# EAGLE design ltc3886_breadboardbreakout (EAGLE 9.3.0)
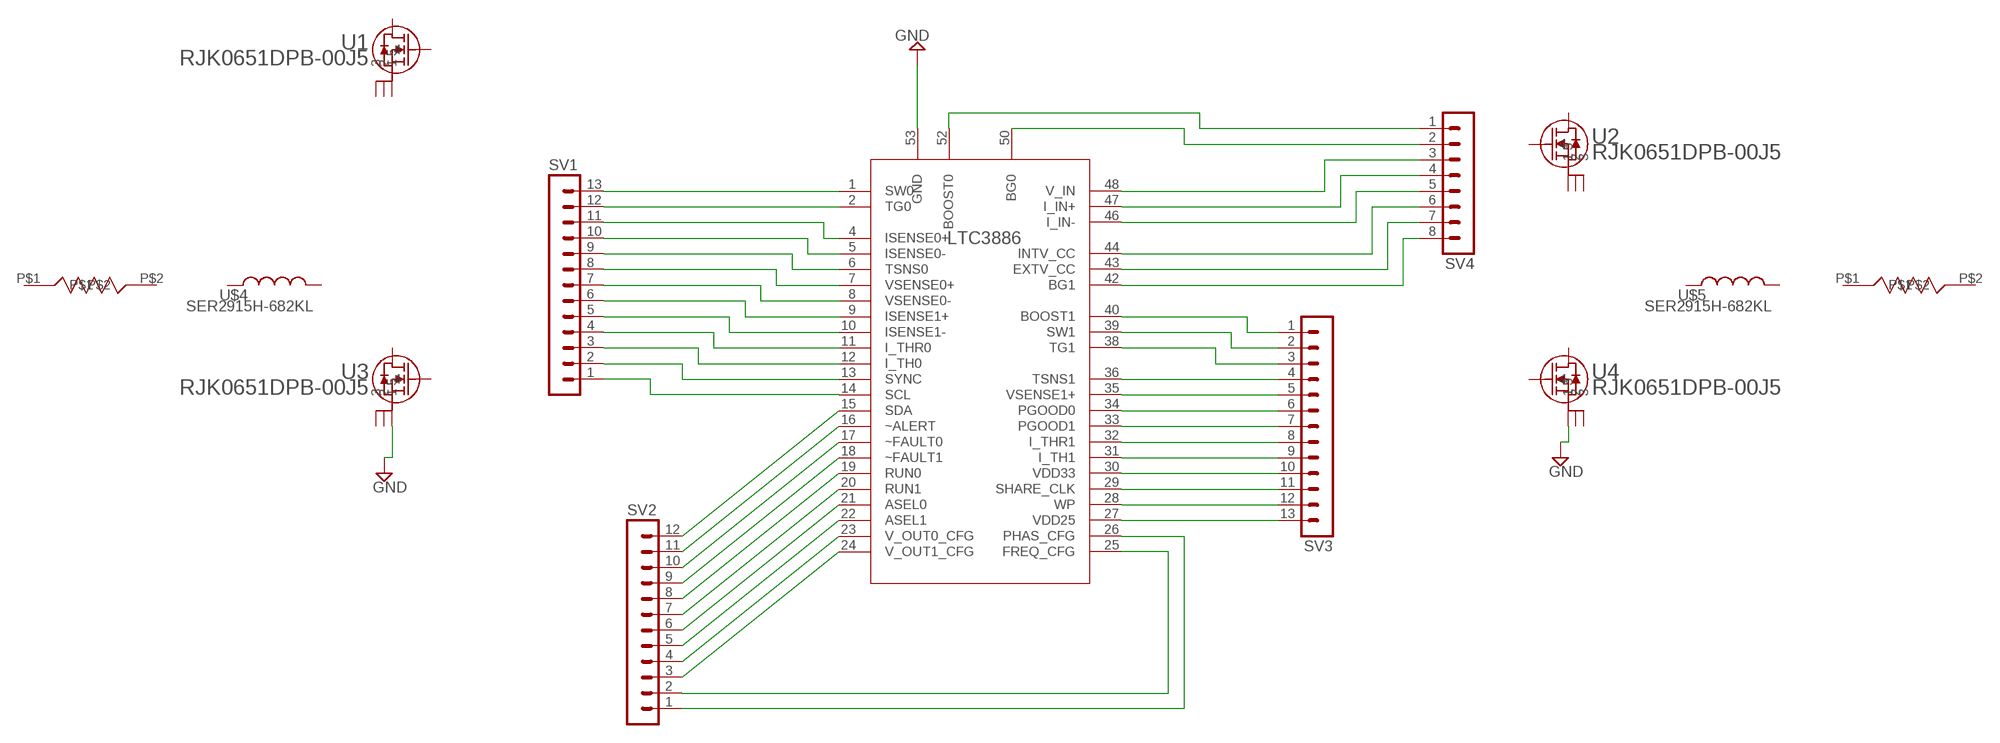
[diagram p0: schematic, sheet 1]

## Parts
GND  LTC3886  [QFN-52_UKG_2]
SV1  MA13-1  [MA13-1]
SV2  MA12-1  [MA12-1]
SV3  MA13-1  [MA13-1]
SV4  MA08-1  [MA08-1]
U1  RJK0651DPB-00J5  [LFPAK]
U2  RJK0651DPB-00J5  [LFPAK]
U3  RJK0651DPB-00J5  [LFPAK]
U4  RJK0651DPB-00J5  [LFPAK]
U$2  CSS2H-2512K-2L00FE  [CSS2H-2512K-2L00FE]
U$3  CSS2H-2512K-2L00FE  [CSS2H-2512K-2L00FE]
U$4  SER2915H-682KL  [SER2915H-682KL]
U$5  SER2915H-682KL  [SER2915H-682KL]

## Nets
GND: GND.53(GND) U3.1 U4.1
N$5: GND.1(SW0) SV1.13
N$6: GND.2(TG0) SV1.12
N$7: GND.4(ISENSE0+) SV1.11
N$8: GND.5(ISENSE0-) SV1.10
N$9: GND.6(TSNS0) SV1.9
N$10: GND.7(VSENSE0+) SV1.8
N$11: GND.8(VSENSE0-) SV1.7
N$12: GND.9(ISENSE1+) SV1.6
N$13: GND.10(ISENSE1-) SV1.5
N$14: GND.11(I_THR0) SV1.4
N$15: GND.12(I_TH0) SV1.3
N$16: GND.13(SYNC) SV1.2
N$17: GND.14(SCL) SV1.1
N$18: GND.24(V_OUT1_CFG) SV2.3
N$19: GND.23(V_OUT0_CFG) SV2.4
N$20: GND.22(ASEL1) SV2.5
N$21: GND.21(ASEL0) SV2.6
N$22: GND.20(RUN1) SV2.7
N$23: GND.19(RUN0) SV2.8
N$24: GND.18(~FAULT1) SV2.9
N$25: GND.17(~FAULT0) SV2.10
N$26: GND.16(~ALERT) SV2.11
N$27: GND.15(SDA) SV2.12
N$28: GND.25(FREQ_CFG) SV2.2
N$29: GND.26(PHAS_CFG) SV2.1
N$30: GND.27(VDD25) SV3.13
N$31: GND.28(WP) SV3.12
N$32: GND.29(SHARE_CLK) SV3.11
N$33: GND.30(VDD33) SV3.10
N$34: GND.31(I_TH1) SV3.9
N$35: GND.32(I_THR1) SV3.8
N$36: GND.33(PGOOD1) SV3.7
N$37: GND.34(PGOOD0) SV3.6
N$38: GND.35(VSENSE1+) SV3.5
N$39: GND.36(TSNS1) SV3.4
N$40: GND.38(TG1) SV3.3
N$41: GND.39(SW1) SV3.2
N$42: GND.40(BOOST1) SV3.1
N$43: GND.42(BG1) SV4.8
N$44: GND.43(EXTV_CC) SV4.7
N$45: GND.44(INTV_CC) SV4.6
N$46: GND.46(I_IN-) SV4.5
N$47: GND.47(I_IN+) SV4.4
N$48: GND.48(V_IN) SV4.3
N$49: GND.50(BG0) SV4.2
N$50: GND.52(BOOST0) SV4.1
Unconnected: U1.1 U1.2 U1.3 U1.4 U1.5 U2.1 U2.2 U2.3 U2.4 U2.5 U3.2 U3.3 U3.4 U3.5 U4.2 U4.3 U4.4 U4.5 U$2.P$1 U$2.P$2 U$3.P$1 U$3.P$2 U$4.P$1 U$4.P$2 U$5.P$1 U$5.P$2

## Library data of the parts
GND = ltc3886:LTC3886
SV1 SV3 = con-lstb:MA13-1: PIN HEADER; OC_FARNELL: unknown; OC_NEWARK: unknown
SV2 = con-lstb:MA12-1: PIN HEADER; OC_FARNELL: unknown; OC_NEWARK: unknown
SV4 = con-lstb:MA08-1: PIN HEADER; OC_FARNELL: unknown; OC_NEWARK: unknown
U1-U4 = SamacSys_Parts:RJK0651DPB-00J5; MANUFACTURER_PART_NUMBER: RJK0651DPB00#J5; VENDOR: Renesas Electronics
U$2 U$3 = power_subsystem_components:CSS2H-2512K-2L00FE
U$4 U$5 = power_subsystem_components:SER2915H-682KL

## Board
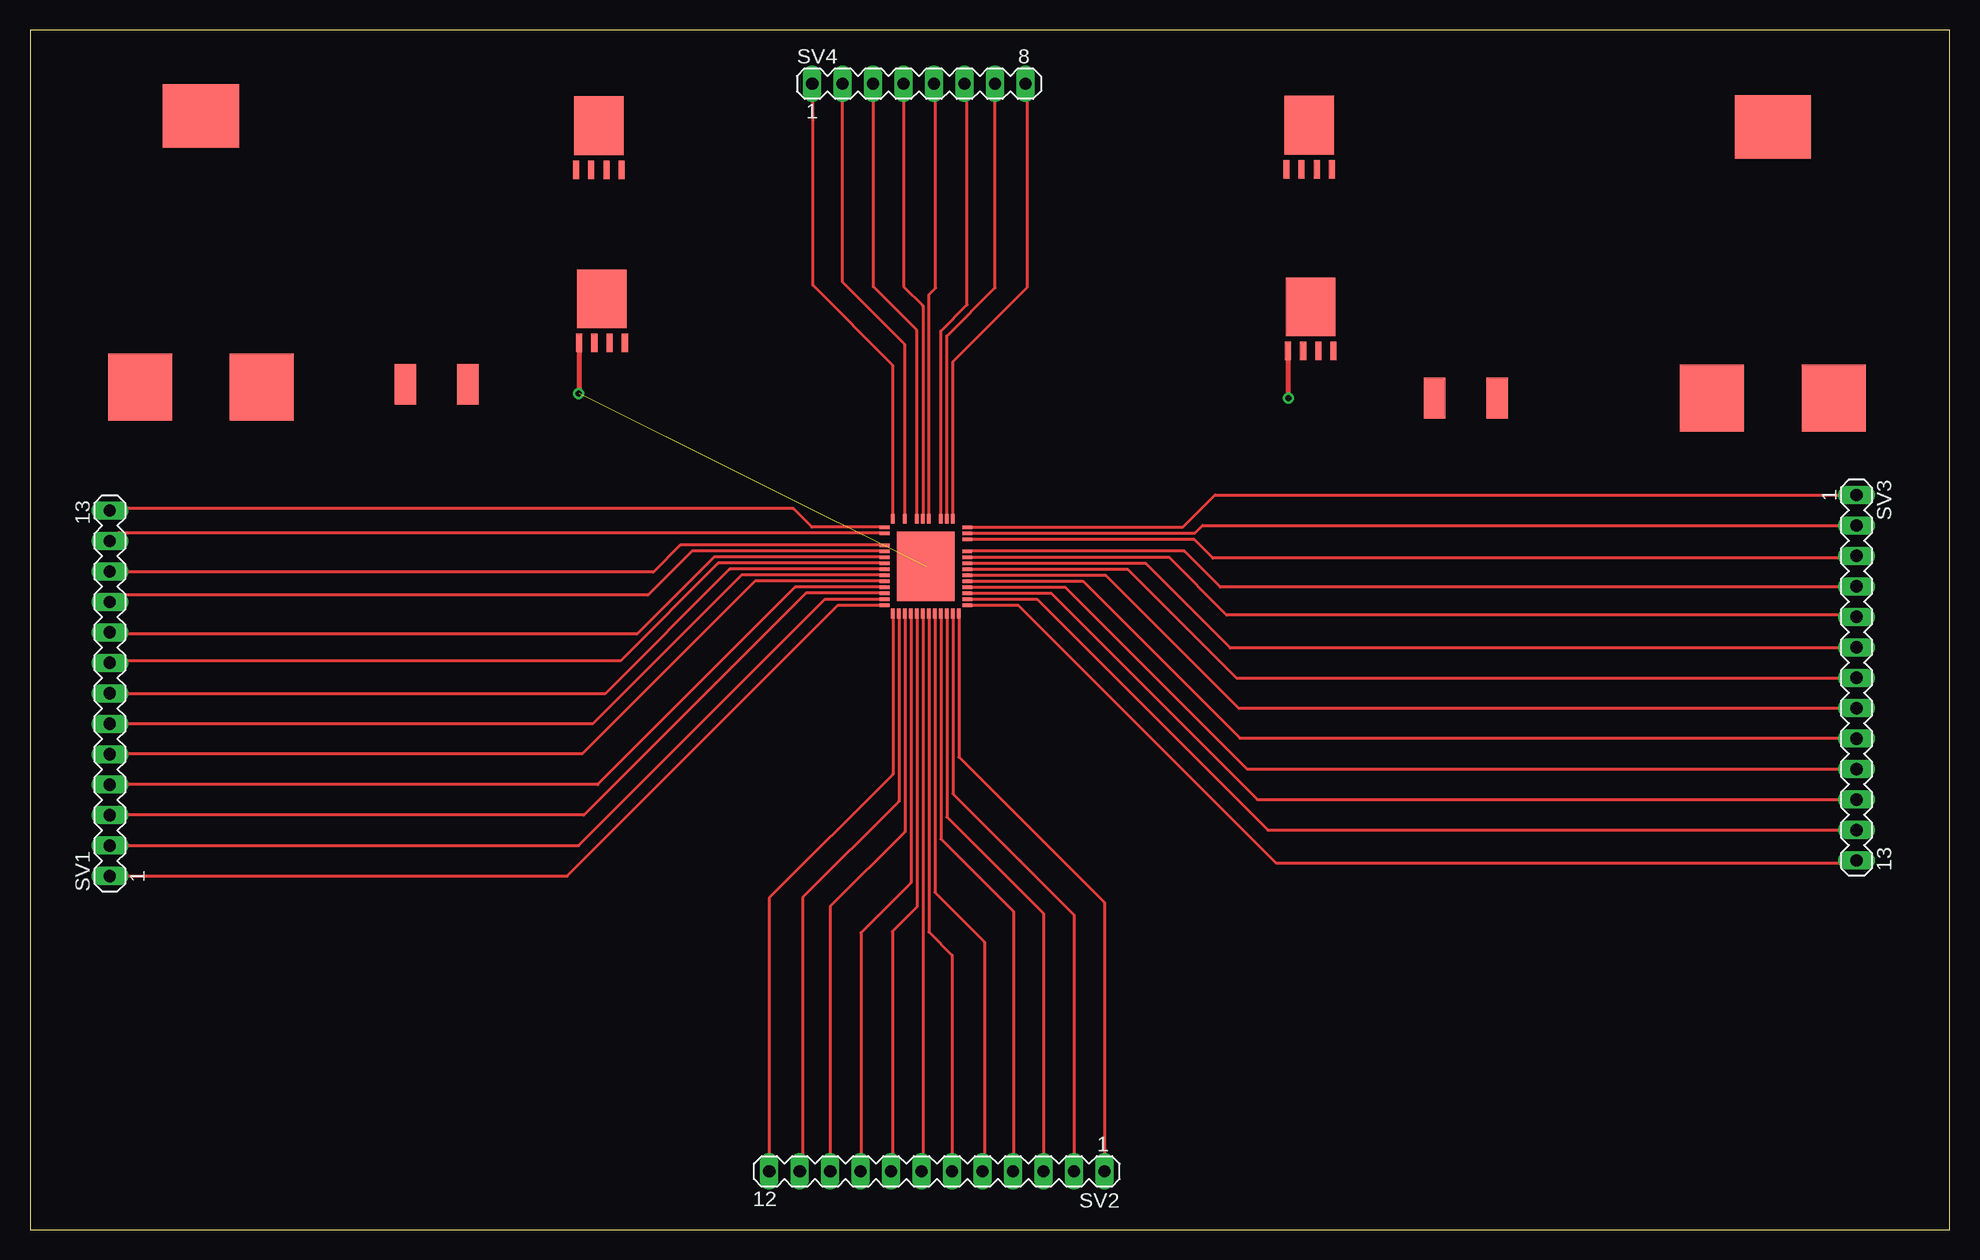
[diagram p1: board, top side]
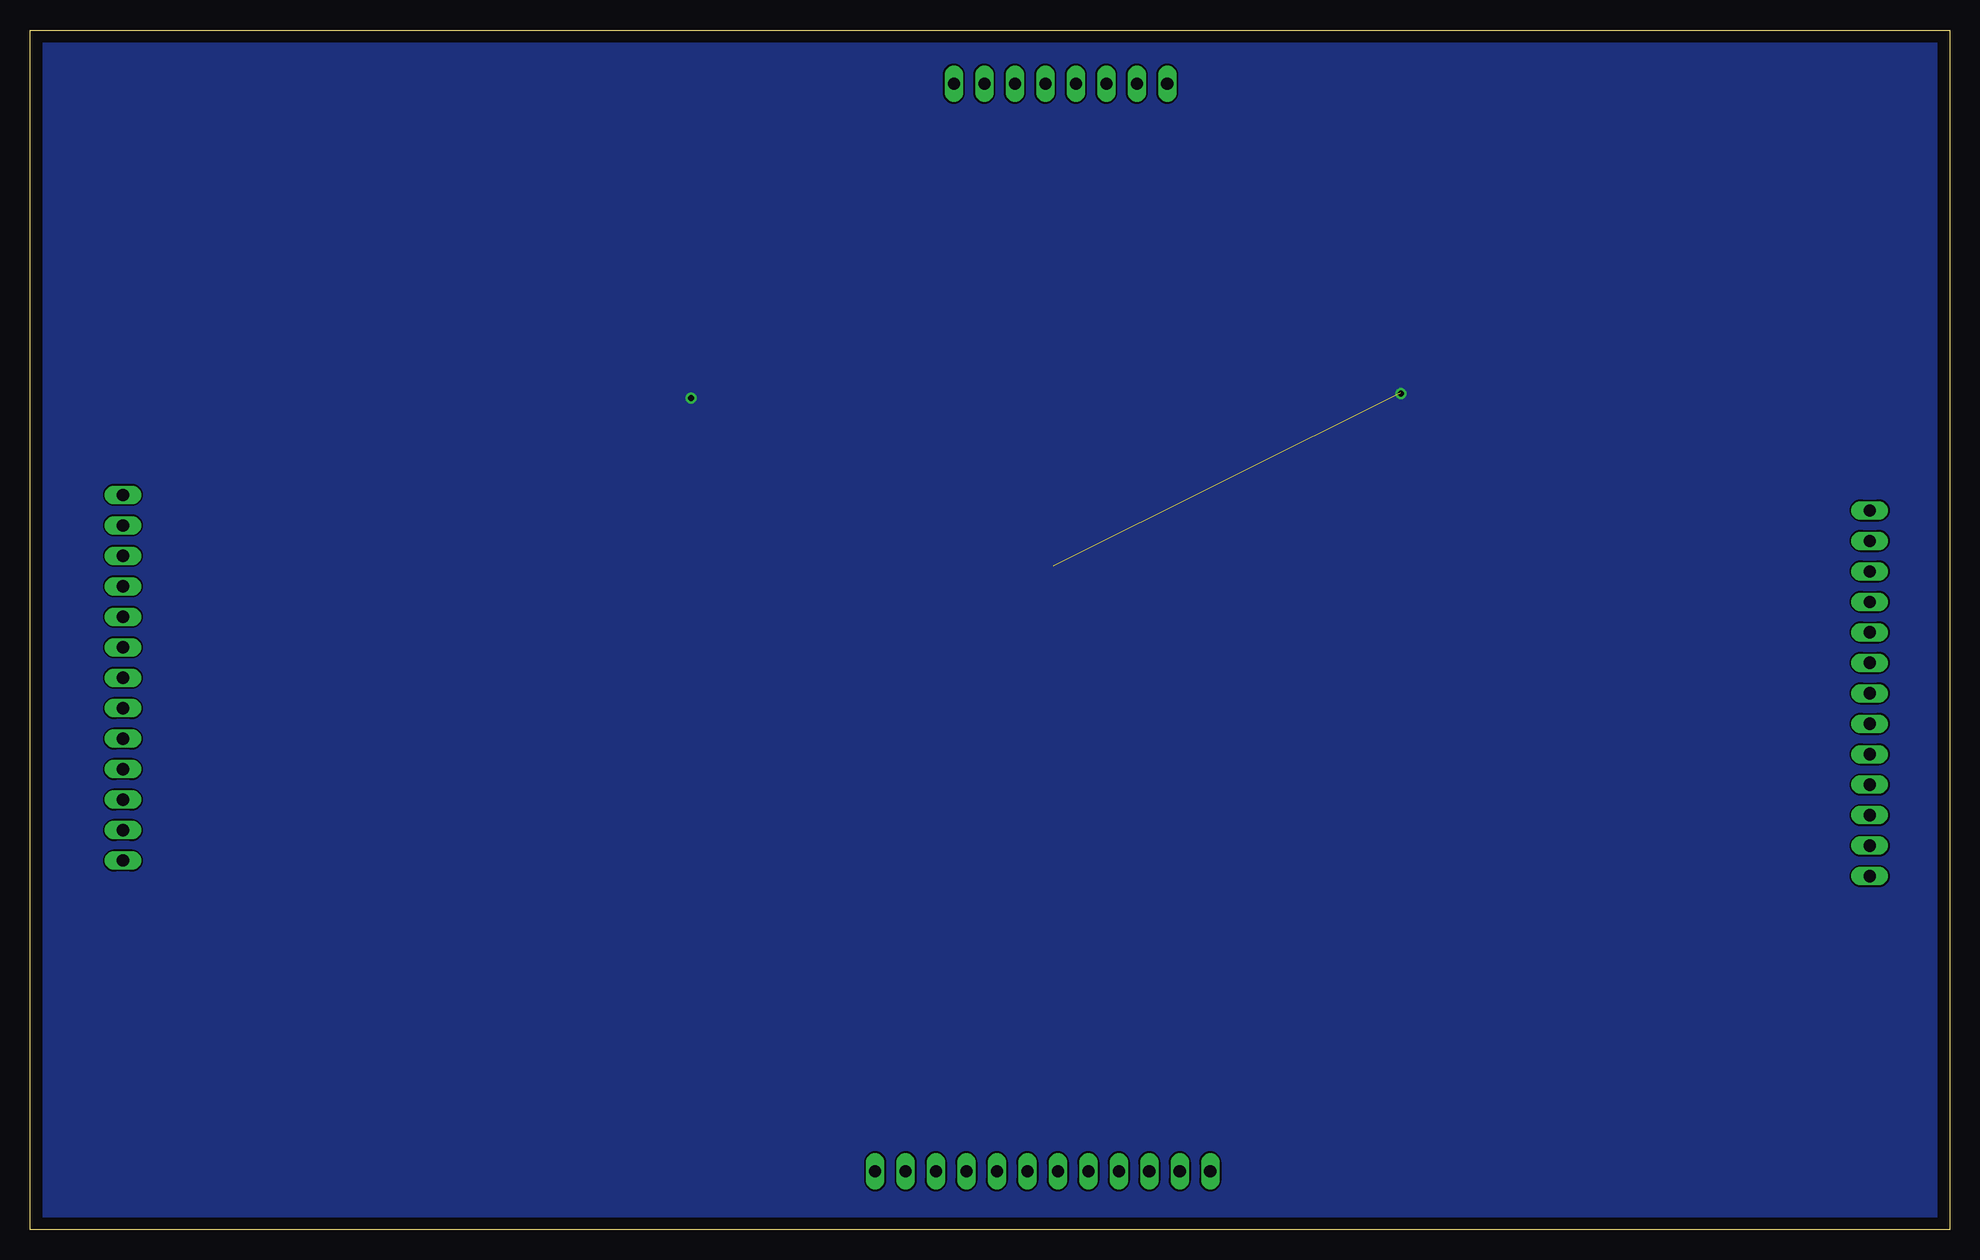
[diagram p2: board, bottom side, seen from below]

Size 160 x 100 mm. Coordinates in mm from the lower left corner, seen from the top.
Outline: 0,0 160,0 160,100 0,100 0,0
Copper layers (1*16): Top 0.035mm / dielectric 1.5mm / Bottom 0.035mm
Design rules "default": minimum track width 6mil, minimum drill 0.35mm, track to track 6mil, track to pad 6mil, pad to pad 6mil, via to via 6mil, smd to smd 6mil, copper to edge 40mil, drill to drill 6mil, minimum pad ring 10mil, minimum via ring 8mil, stop-mask expansion 4mil, vias tented up to drill 0mil, thermal gap 10mil

### Footprints (pad centres in the part's own frame; a part is rotated, then mirrored left to right if it is on the bottom)
QFN-52_UKG_2 = smd 0.813 x 0.305: 1 -3.454,3.25; 2 -3.454,2.75; 4 -3.454,1.75; 5 -3.454,1.25; 6 -3.454,0.75; 7 -3.454,0.25; 8 -3.454,-0.25; 9 -3.454,-0.75; 10 -3.454,-1.25; 11 -3.454,-1.75; 12 -3.454,-2.25; 13 -3.454,-2.75; 14 -3.454,-3.25; 27 3.454,-3.25; 28 3.454,-2.75; 29 3.454,-2.25; 30 3.454,-1.75; 31 3.454,-1.25; 32 3.454,-0.75; 33 3.454,-0.25; 34 3.454,0.25; 35 3.454,0.75; 36 3.454,1.25; 38 3.454,2.25; 39 3.454,2.75; 40 3.454,3.25 | smd 0.305 x 0.813: 15 -2.75,-3.95; 16 -2.25,-3.95; 17 -1.75,-3.95; 18 -1.25,-3.95; 19 -0.75,-3.95; 20 -0.25,-3.95; 21 0.25,-3.95; 22 0.75,-3.95; 23 1.25,-3.95; 24 1.75,-3.95; 25 2.25,-3.95; 26 2.75,-3.95; 42 2.25,3.95; 43 1.75,3.95; 44 1.25,3.95; 46 0.25,3.95; 47 -0.25,3.95; 48 -0.75,3.95; 50 -1.75,3.95; 52 -2.75,3.95 | smd 4.801 x 5.791: 53 0,0
MA13-1 = drill 1.016 long: 1 -15.24,0; 2 -12.7,0; 3 -10.16,0; 4 -7.62,0; 5 -5.08,0; 6 -2.54,0; 7 0,0; 8 2.54,0; 9 5.08,0; 10 7.62,0; 11 10.16,0; 12 12.7,0; 13 15.24,0
MA12-1 = drill 1.016 long: 1 -13.97,0; 2 -11.43,0; 3 -8.89,0; 4 -6.35,0; 5 -3.81,0; 6 -1.27,0; 7 1.27,0; 8 3.81,0; 9 6.35,0; 10 8.89,0; 11 11.43,0; 12 13.97,0
MA08-1 = drill 1.016 long: 1 -8.89,0; 2 -6.35,0; 3 -3.81,0; 4 -1.27,0; 5 1.27,0; 6 3.81,0; 7 6.35,0; 8 8.89,0
LFPAK = smd 1.549 x 0.508: 1 -2.68,1.905; 2 -2.68,0.635; 3 -2.68,-0.635; 4 -2.68,-1.905 | smd 4.902 x 4.14: 5 1.003,0
CSS2H-2512K-2L00FE = smd 1.8 x 3.4: P$1 -3,0; P$2 2.2,0
SER2915H-682KL = smd 5.33 x 5.59: P$1 -5.075,0; P$2 5.075,0 | smd 6.35 x 5.28: P$3 0,22.6

### Placement (x,y rotation side)
GND  74.68,55.3 0 top
SV1  6.65,44.7 90 top
SV2  75.59,4.85 180 top
SV3  152.25,46 270 top
SV4  74.09,95.53 0 top
U1  47.42,91.01 90 top
U2  106.63,91.06 90 top
U3  47.68,76.58 90 top
U4  106.76,75.92 90 top
U$2  120.09,69.32 0 top
U$3  34.29,70.46 0 top
U$4  145.26,69.32 0 top
U$5  14.25,70.23 0 top

### Tracks (layer width: path | path; a pad name or v marks a point on that pad's centre or on a via)
GND  (via drill 0.51)  (1 unrouted)
  Top 0.406: U3.1 45.77,69.72 v45.74,69.7 | U4.1 104.85,69.37 v104.9,69.32
  pour Bottom: -10.06,103.4 170,103.4 170,-10.41 -13.51,-10.41 -13.51,-2.51 -13.51,103.4 -11,103.4
N$5
  Top 0.254: GND.1 65.18,58.55 63.63,60.1 6.81,60.1 SV1.13
N$6
  Top 0.254: GND.2 7.3,58.05 SV1.12
N$7
  Top 0.254: GND.4 54.2,57.05 51.97,54.81 6.71,54.81 SV1.11
N$8
  Top 0.254: GND.5 55.17,56.55 51.51,52.89 7.22,52.89 SV1.10
N$9
  Top 0.254: SV1.9 6.81,49.63 50.6,49.63 57.01,56.05 GND.6
N$10
  Top 0.254: GND.7 57.38,55.55 49.23,47.4 6.81,47.4 SV1.8
N$11
  Top 0.254: SV1.7 6.71,44.65 47.93,44.65 58.32,55.05 GND.8
N$12
  Top 0.254: GND.9 59.3,54.55 46.91,42.16 SV1.6
N$13
  Top 0.254: GND.10 60.42,54.05 46.02,39.65 6.68,39.65 SV1.5
N$14
  Top 0.254: SV1.4 47.32,37.08 63.78,53.55 GND.11
N$15
  Top 0.254: SV1.3 46.18,34.54 64.68,53.05 GND.12
N$16
  Top 0.254: SV1.2 45.74,32 66.29,52.55 GND.13
N$17
  Top 0.254: GND.14 67.36,52.05 44.78,29.46 SV1.1
N$18
  Top 0.254: GND.24 76.43,34.39 84.48,26.34 SV2.3
N$19
  Top 0.254: GND.23 75.93,32.56 81.97,26.52 81.97,4.88 SV2.4
N$20
  Top 0.254: GND.22 75.43,28.1 79.55,23.98 79.55,5 SV2.5
N$21
  Top 0.254: GND.21 74.93,24.79 76.86,22.86 SV2.6
N$22
  Top 0.254: GND.20 74.43,4.96 SV2.7
N$23
  Top 0.254: GND.19 73.93,26.89 71.88,24.84 71.88,4.95 SV2.8
N$24
  Top 0.254: GND.18 73.43,28.9 69.27,24.74 69.27,4.88 SV2.9
N$25
  Top 0.254: GND.17 72.93,33.15 66.7,26.92 SV2.10
N$26
  Top 0.254: GND.16 72.43,35.7 64.41,27.69 64.41,5.11 SV2.11
N$27
  Top 0.254: GND.15 71.93,37.94 61.62,27.64 SV2.12
N$28
  Top 0.254: GND.25 76.93,36.33 87.02,26.24 SV2.2
N$29
  Top 0.254: GND.26 77.43,39.39 89.56,27.25 SV2.1
N$30
  Top 0.254: GND.27 82.37,52.05 103.89,30.53 152.02,30.53 SV3.13
N$31
  Top 0.254: GND.28 83.93,52.55 103.17,33.3 SV3.12
N$32
  Top 0.254: GND.29 85.11,53.05 102.31,35.84 SV3.11
N$33
  Top 0.254: GND.30 86.28,53.55 101.45,38.38 SV3.10
N$34
  Top 0.254: GND.31 87.76,54.05 100.84,40.97 152.2,40.97 SV3.9
N$35
  Top 0.254: GND.32 89.65,54.55 100.74,43.46 SV3.8
N$36
  Top 0.254: GND.33 91.49,55.05 100.58,45.95 152.2,45.95 SV3.7
N$37
  Top 0.254: GND.34 92.97,55.55 100.05,48.46 152.17,48.46 SV3.6
N$38
  Top 0.254: GND.35 94.92,56.05 99.75,51.22 152.11,51.22 SV3.5
N$39
  Top 0.254: SV3.4 152.18,53.55 99.21,53.55 96.22,56.55 GND.36
N$40
  Top 0.254: GND.38 97.03,57.55 98.6,55.97 152.06,55.97 SV3.3
N$41
  Top 0.254: GND.39 97.09,58.05 97.74,58.7 SV3.2
N$42
  Top 0.254: GND.40 96.09,58.55 98.78,61.24 SV3.1
N$43
  Top 0.254: GND.42 76.93,72.35 83.13,78.56 83.13,95.38 SV4.8
N$44
  Top 0.254: GND.43 76.43,74.5 80.44,78.51 SV4.7
N$45
  Top 0.254: GND.44 75.93,74.91 78.11,77.09 78.11,95.33 SV4.6
N$46
  Top 0.254: GND.46 74.93,77.92 75.49,78.49 75.49,95.4 SV4.5
N$47
  Top 0.254: GND.47 74.43,77.01 72.82,78.61 SV4.4
N$48
  Top 0.254: GND.48 73.93,74.97 70.31,78.59 70.31,95.5 SV4.3
N$49
  Top 0.254: GND.50 72.93,73.78 67.74,78.97 SV4.2
N$50
  Top 0.254: GND.52 71.93,72.04 65.25,78.72 65.25,95.48 SV4.1